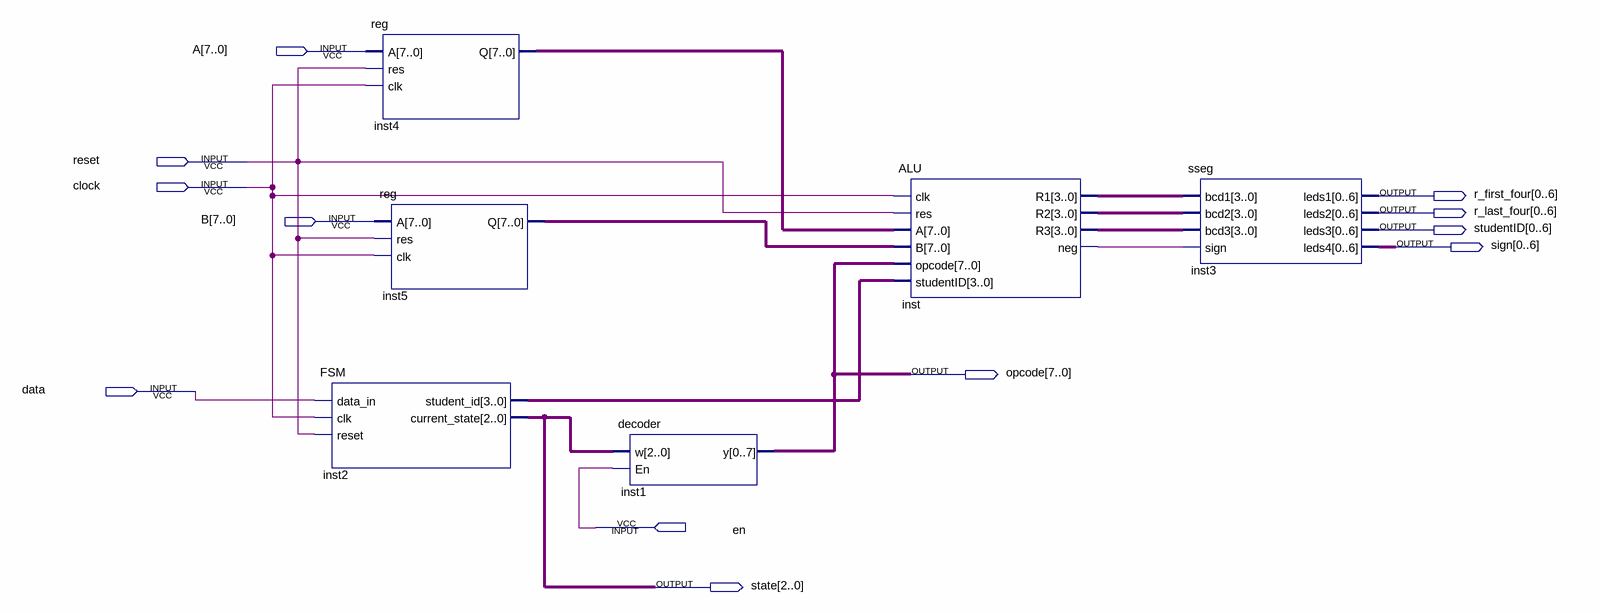
[diagram p0: schematic sheet]
// Quartus schematic CPU.bdf as structural Verilog: 6 symbols, 12 pins
module CPU (
  input  [7:0] A,
  input  reset,
  input  clock,
  input  [7:0] B,
  input  data,
  input  en,
  output [0:6] r_first_four,
  output [0:6] r_last_four,
  output [0:6] studentID,
  output [0:6] sign,
  output [7:0] opcode,
  output [2:0] state
);

  wire inst_neg;
  wire [3:0] inst2_student_id, inst_r1, inst_r2, inst_r3;
  wire [7:0] inst4_q, inst5_q;

  FSM inst2 (.data_in(data), .clk(clock), .reset(reset), .student_id(inst2_student_id), .current_state(state));
  \reg  inst4 (.A(A), .res(reset), .clk(clock), .Q(inst4_q));
  \reg  inst5 (.A(B), .res(reset), .clk(clock), .Q(inst5_q));
  decoder inst1 (.w(state), .En(en), .y(opcode));
  ALU inst (
    .clk(clock), .res(reset), .A(inst4_q), .B(inst5_q), .opcode(opcode), .studentID(inst2_student_id),
    .R1(inst_r1), .R2(inst_r2), .R3(inst_r3), .neg(inst_neg));
  sseg inst3 (
    .bcd1(inst_r1), .bcd2(inst_r2), .bcd3(inst_r3), .sign(inst_neg), .leds1(r_first_four),
    .leds2(r_last_four), .leds3(studentID), .leds4(sign));
endmodule
